# EAGLE schematic untitled (EAGLE 9.6.2)
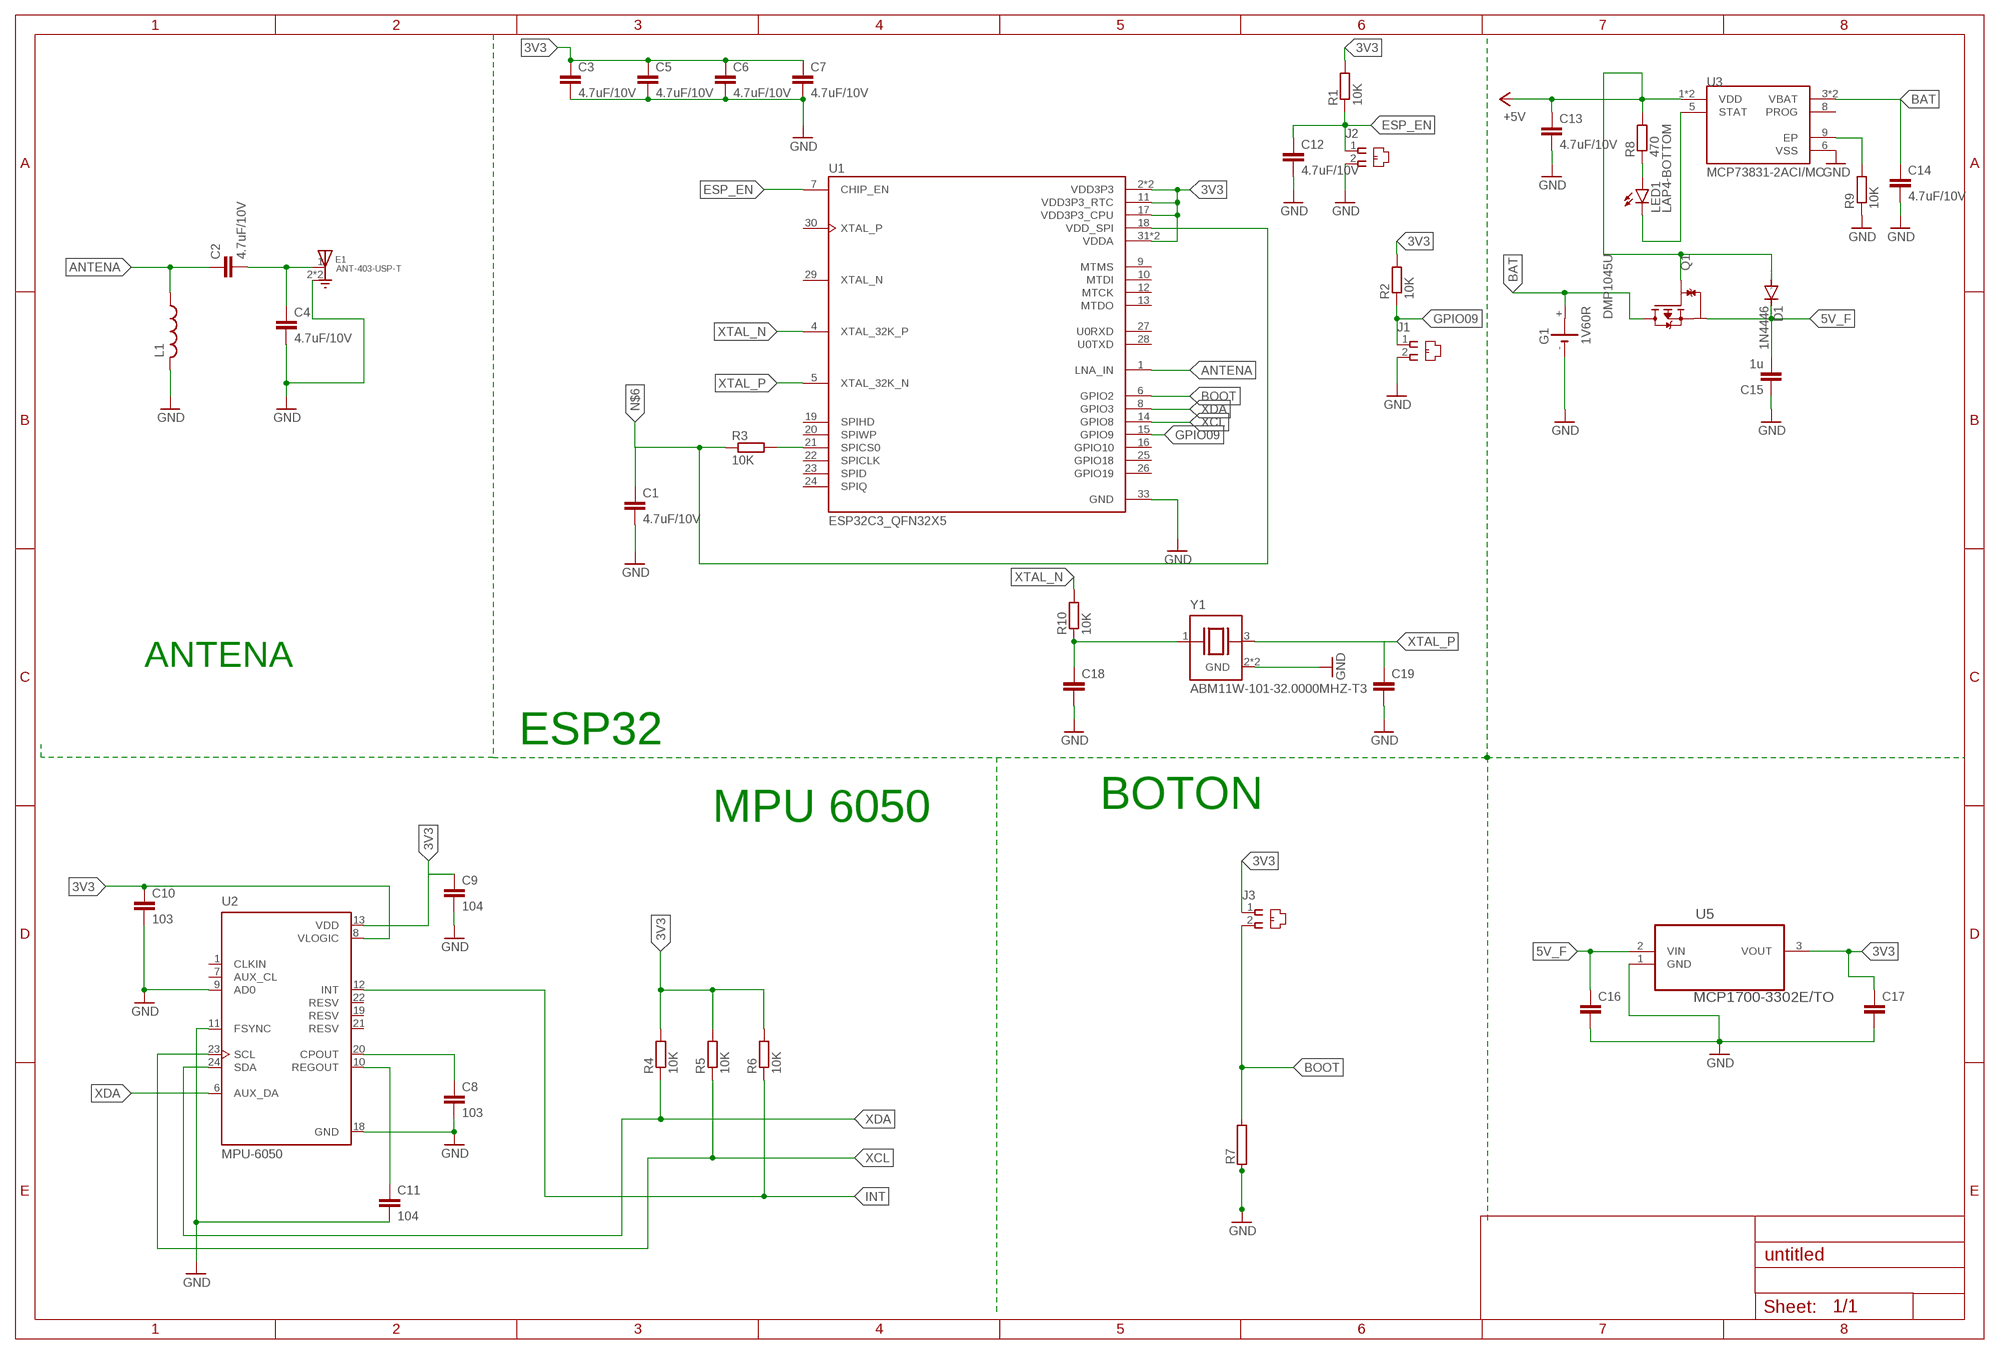
[diagram p0: schematic, sheet 1]

## Parts
C1  4.7uF/10V  C2,5-3  [C2.5-3]
C2  4.7uF/10V  C2,5-3  [C2.5-3]
C3  4.7uF/10V  C2,5-3  [C2.5-3]
C4  4.7uF/10V  C2,5-3  [C2.5-3]
C5  4.7uF/10V  C2,5-3  [C2.5-3]
C6  4.7uF/10V  C2,5-3  [C2.5-3]
C7  4.7uF/10V  C2,5-3  [C2.5-3]
C8  103  C2,5-3  [C2.5-3]
C9  104  C2,5-3  [C2.5-3]
C10  103  C2,5-3  [C2.5-3]
C11  104  C2,5-3  [C2.5-3]
C12  4.7uF/10V  C2,5-3  [C2.5-3]
C13  4.7uF/10V  C2,5-3  [C2.5-3]
C14  4.7uF/10V  C2,5-3  [C2.5-3]
C15  1u  C2,5-3  [C2.5-3]
C16  C2,5-3  [C2.5-3]
C17  C2,5-3  [C2.5-3]
C18  C2,5-3  [C2.5-3]
C19  C2,5-3  [C2.5-3]
D1  1N4446  [DO35-10]
E1  ANT-403-USP-T  [XDCR_ANT-403-USP-T]
G1  1V60R  [1V60R]
J1  520250-1  [520250-1]
J2  520250-1  [520250-1]
J3  520250-1  [520250-1]
L1  L-US0204/5  [0204/5]
LED1  LAP4-BOTTOM  [P47F-BOTTOM]
Q1  DMP1045U  [SOT91P240X110-3N]
R1  10K  R-EU_0204/2V  [0204V]
R2  10K  R-EU_0204/2V  [0204V]
R3  10K  R-EU_0204/2V  [0204V]
R4  10K  R-EU_0204/2V  [0204V]
R5  10K  R-EU_0204/2V  [0204V]
R6  10K  R-EU_0204/2V  [0204V]
R7  RAC03  [AC03]
R8  470  R-EU_0204/2V  [0204V]
R9  10K  R-EU_0204/2V  [0204V]
R10  10K  R-EU_0204/2V  [0204V]
U1  ESP32C3_QFN32X5  [QFN32_5X5MM]
U2  MPU-6050  [QFN50P400X400X95-24N]
U3  MCP73831-2ACI/MC  [SON50P200X300X100-9N]
U5  MCP1700-3302E/TO  [TO127P254X495-3]
Y1  ABM11W-101-32.0000MHZ-T3  [XTAL_ABM11W-101-32.0000MHZ-T3]

## Nets
3V3: C3.1 C5.1 C6.1 C7.1 C9.1 C10.1 C17.1 J3.1 R1.2 R2.2 R4.2 R5.2 R6.2 U1.2(VDD3P3) U1.3(VDD3P3) U1.11(VDD3P3_RTC) U1.17(VDD3P3_CPU) U1.31(VDDA) U1.32(VDDA) U2.8(VLOGIC) U2.13(VDD) U5.3(VOUT)
5V_F: C15.2 C16.1 D1.C Q1.2(S) U5.2(VIN)
+5V: C13.1 D1.A Q1.1(G) R8.2 U3.1(VDD) U3.2(VDD)
ANTENA: U1.1(LNA_IN)
BAT: C14.1 G1.+ Q1.3(D) U3.3(VBAT) U3.4(VBAT)
BOOT: J3.2 R7.2 U1.6(GPIO2)
ESP_EN: C12.1 J2.1 R1.1 U1.7(CHIP_EN)
GND: C1.2 C3.2 C5.2 C6.2 C7.2 C8.2 C9.2 C10.2 C11.2 C12.2 C13.2 C14.2 C15.1 C16.2 C17.2 C18.2 C19.2 G1.- J1.2 J2.2 L1.2 R7.1 R9.1 U1.33(GND) U2.9(AD0) U2.11(FSYNC) U2.18(GND) U3.6(VSS) U5.1(GND) Y1.2(GND) Y1.4(GND)
GND2: C4.2 E1.2(GND) E1.3(GND) ; supply symbol labelled GND
GPIO09: J1.1 R2.1 U1.15(GPIO9)
INT: R6.1 U2.12(INT)
N$1: LED1.A R8.1
N$2: C2.1 L1.1
N$3: LED1.C U3.5(STAT)
N$4: R9.2 U3.9(EP)
N$5: R3.2 U1.21(SPICS0)
N$6: C1.1 R3.1 U1.18(VDD_SPI)
N$7: C8.1 U2.20(CPOUT)
N$9: C2.2 C4.1 E1.1(FEEDING)
N$10: C11.1 U2.10(REGOUT)
N$12: C18.1 R10.1 Y1.1
N$13: C19.1
XCL: R5.1 U1.14(GPIO8) U2.23(SCL)
XDA: R4.1 U1.8(GPIO3) U2.6(AUX_DA) U2.24(SDA)
XTAL_N: R10.2 U1.4(XTAL_32K_P)
XTAL_P: U1.5(XTAL_32K_N) Y1.3
Unconnected: G1.+@1(+) U1.9(MTMS) U1.10(MTDI) U1.12(MTCK) U1.13(MTDO) U1.16(GPIO10) U1.19(SPIHD) U1.20(SPIWP) U1.22(SPICLK) U1.23(SPID) U1.24(SPIQ) U1.25(GPIO18) U1.26(GPIO19) U1.27(U0RXD) U1.28(U0TXD) U1.29(XTAL_N) U1.30(XTAL_P) U2.1(CLKIN) U2.7(AUX_CL) U2.19(RESV) U2.21(RESV) U2.22(RESV) U3.8(PROG)

## Notes on the sheet
- ANTENA
- ESP32
- MPU 6050 | BOTON

## Library data of the parts
C1-C19 = capacitor-wima:C: CAPACITOR naming: grid - package width
D1 = diode:1N4446: DIODE high speed (Philips)
E1 = ANT-403-USP-T:ANT-403-USP-T: 403 MHz 1/4 Wave -8.7 dBi SMT MicroSplatch Planar Antenna Check availability <https://pricing.snapeda.com/parts/ANT-403-USP-T/Linx%20Technologies/view-part?ref=eda>; AVAILABILITY: In Stock; CHECK_PRICES: https://www.snapeda.com/parts/ANT-403-USP-T/Linx/view-part/?ref=eda; DESCRIPTION: 403 MHz Monopole Chip Antenna; MF: Linx Technologies; MP: ANT-403-USP-T; PACKAGE: None; PRICE: None; SNAPEDA_LINK: https://www.snapeda.com/parts/ANT-403-USP-T/Linx/view-part/?ref=snap
G1 = battery:1V60R: NC ACCU Varta
J1-J3 = con-amp:520250-1: AMP connector
L1 = rcl:L-US: INDUCTOR, American symbol; SPICEPREFIX: L
LED1 = led:*P4: PointLED® Enhanced Thinfilm LED TOP & BOTTOM mount LS P47F, LR P47F, LA P47F, LY P47F, LT P4SG, LB P4SG, LW P4SG Source: http://catalog.osram-os.com .. LA_LR_LS_LY_P47F_Pb_free.pdf
Q1 = DMP1045U:DMP1045U: P-Channel 12V 4A (Ta) 800mW (Ta) Surface Mount SOT-23 Check availability <https://pricing.snapeda.com/parts/DMP1045U/Diodes%20Inc./view-part?ref=eda>; AVAILABILITY: In Stock; CHECK_PRICES: https://www.snapeda.com/parts/DMP1045U/Diodes+Inc./view-part/?ref=eda; DESCRIPTION: P-Channel 12 V 2.6A (Ta) 530mW Surface Mount X2-WLB0808-4 (Type C); MF: Diodes Inc.; MP: DMP1045U; PACKAGE: SOT-23 Diodes Inc.; PRICE: None; SNAPEDA_LINK: https://www.snapeda.com/parts/DMP1045U/Diodes+Inc./view-part/?ref=snap
R1-R6 R8-R10 = rcl:R-EU_: RESISTOR, European symbol; SPICEPREFIX: R
R7 = resistor-power:R: Power Resitor; OC_FARNELL: unknown; OC_NEWARK: unknown
U1 = ESP32C3:ESP32C3: Check availability <https://pricing.snapeda.com/parts/ESP32-C3/Espressif%20Systems/view-part?ref=eda>; AVAILABILITY: In Stock; CHECK_PRICES: https://www.snapeda.com/parts/ESP32-C3/Espressif+Systems/view-part/?ref=eda; DESCRIPTION: WiFi Modules (802.11) (Engineering Samples Only) SMD IC ESP32-C3, RISC-V single-core MCU, 2.4G Wi-Fi & BLE 5.0 combo, QFN 32-pin, 5*5 mm, 40 ~ 105C; MF: Espressif Systems; MP: ESP32-C3; PACKAGE: VFQFN-32 Espressif Systems; PRICE: None; PURCHASE-URL: https://www.snapeda.com/api/url_track_click_mouser/?unipart_id=5833677&manufacturer=Espressif Systems&part_name=ESP32-C3&search_term=esp32 c3; SNAPEDA_LINK: https://www.snapeda.com/parts/ESP32-C3/Espressif+Systems/view-part/?ref=snap
U2 = MPU-6050:MPU-6050: MPU-6050 Six-Axis (Gyro + Accelerometer) MEMS MotionTracking™ Devices Check availability <https://pricing.snapeda.com/parts/MPU-6050/TDK%20InvenSense/view-part?ref=eda>; AVAILABILITY: In Stock; CHECK_PRICES: https://www.snapeda.com/parts/MPU-6050/TDK+InvenSense/view-part/?ref=eda; DESCRIPTION: MPU-6050 series Accelerometer, Gyroscope, 3 Axis Sensor Evaluation Board; MF: TDK InvenSense; MP: MPU-6050; PACKAGE: QFN-24 InvenSense; PRICE: None; PURCHASE-URL: https://www.snapeda.com/api/url_track_click_mouser/?unipart_id=43944&manufacturer=TDK InvenSense&part_name=MPU-6050&search_term=mpu6050; SNAPEDA_LINK: https://www.snapeda.com/parts/MPU-6050/TDK+InvenSense/view-part/?ref=snap
U3 = MCP73831-2ACI_MC:MCP73831-2ACI/MC: MCP73831 Series Single-Cell Li-Ion/Li-Polymer Battery Charge Controller - DFN-8 Check availability <https://pricing.snapeda.com/parts/MCP73831-2ACI/MC/Microchip/view-part?ref=eda>; AVAILABILITY: In Stock; CHECK_PRICES: https://www.snapeda.com/parts/MCP73831-2ACI/MC/Microchip/view-part/?ref=eda; DESCRIPTION: Charge Controller Li-Ion/Li-Pol 15mA to 500mA 4.2V 8-Pin DFN EP | Microchip Technology Inc. MCP73831-2ACI/MC; MF: Microchip; MP: MCP73831-2ACI/MC; PACKAGE: VFDFN-8 Microchip; PRICE: None; SNAPEDA_LINK: https://www.snapeda.com/parts/MCP73831-2ACI/MC/Microchip/view-part/?ref=snap
U5 = MCP1700-3302E_TO:MCP1700-3302E/TO: IC LDO REG 250MA 5.0V Check availability <https://pricing.snapeda.com/parts/MCP1700-3302E/TO/Microchip/view-part?ref=eda>; AVAILABILITY: In Stock; CHECK_PRICES: https://www.snapeda.com/parts/MCP1700-3302E/TO/Microchip/view-part/?ref=eda; DESCRIPTION: Pwr Sply Func,Voltage Regulator,LDO,TO-92,PD 644mW,VO 3.3V,Regline +/-0.75%/V | Microchip Technology Inc. MCP1700-3302E/TO; MF: Microchip; MP: MCP1700-3302E/TO; PACKAGE: TO-92 Microchip; PRICE: None; SNAPEDA_LINK: https://www.snapeda.com/parts/MCP1700-3302E/TO/Microchip/view-part/?ref=snap
Y1 = ABM11W-101-32.0000MHZ-T3:ABM11W-101-32.0000MHZ-T3: Check availability <https://pricing.snapeda.com/parts/ABM11W-101-32.0000MHZ-T3/Abracon%20LLC/view-part?ref=eda>; AVAILABILITY: In Stock; CHECK_PRICES: https://www.snapeda.com/parts/ABM11W-101-32.0000MHZ-T3/Abracon+LLC/view-part/?ref=eda; DESCRIPTION: IoT OPTIMIZED LOW PROFILE QUARTZ CRYSTAL; MF: Abracon LLC; MP: ABM11W-101-32.0000MHZ-T3; PACKAGE: SMD-4 Abracon LLC; PRICE: None; SNAPEDA_LINK: https://www.snapeda.com/parts/ABM11W-101-32.0000MHZ-T3/Abracon+LLC/view-part/?ref=snap